# Altium schematic sheet BOOST Converter-EV3432-L-00A.SchDoc
size A4; SheetNumber: 1; SheetTotal: 2
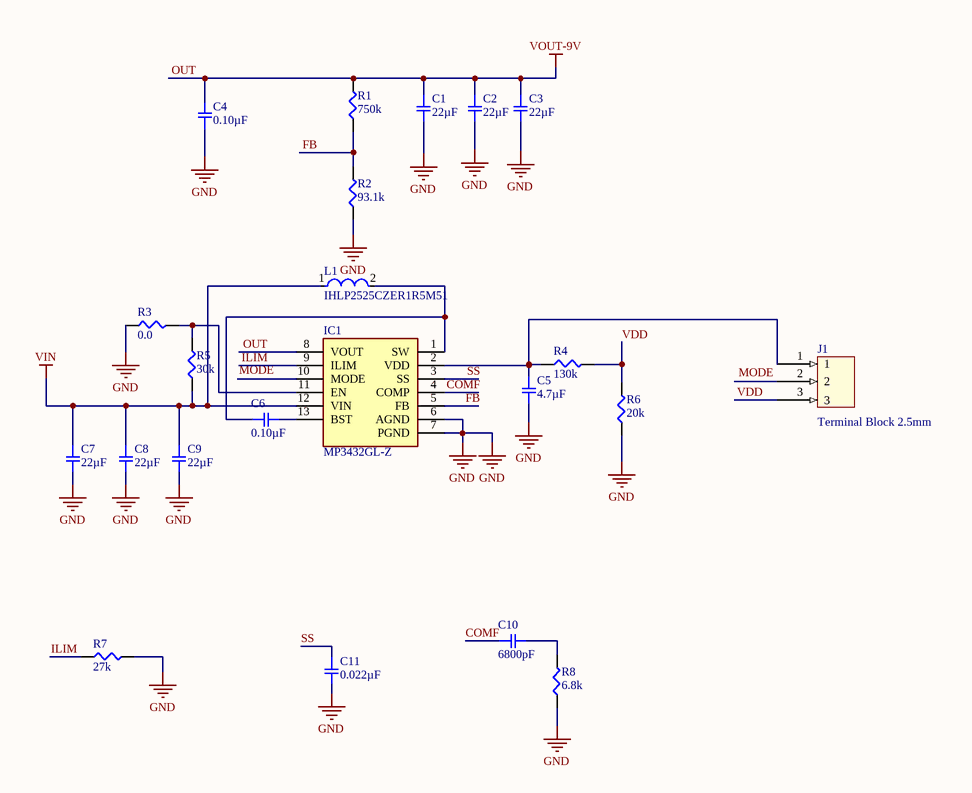
[diagram p0: BOOST Converter-EV3432-L-00A.SchDoc]

## Parts
C1  22µF  [SMD-1206C]
C2  22µF  [SMD-1206C]
C3  22µF  [SMD-1206C]
C4  0.10µF  [SMD-0402C]
C5  4.7µF  [SMD-0402C]
C6  0.10µF  [SMD-0402C]
C7  22µF  [SMD-1206C]
C8  22µF  [SMD-1206C]
C9  22µF  [SMD-1206C]
C10  6800pF  [SMD-0402C]
C11  0.022µF  [SMD-0402C]
IC1  MP3432GL-Z  [MP3432GLZ]
J1  Terminal Block 2.5mm  [CON3_100_TB_TH_ST]
L1  IHLP2525CZER1R5M51  [FP-IHLP-2525CZ-FP_2_413x3-MFG]
R1  750k  [SMD-0402-RES]
R2  93.1k  [SMD-0402-RES]
R3  0.0  [SMD-0402-RES]
R4  130k  [SMD-0402-RES]
R5  30k  [SMD-0402-RES]
R6  20k  [SMD-0402-RES]
R7  27k  [SMD-0402-RES]
R8  6.8k  [SMD-0402-RES]

## Nets
GND: C1.2 C2.2 C3.2 C4.1 C5.2 C7.2 C8.2 C9.2 C11.2 IC1.6(AGND) IC1.7(PGND) R2.1 R3.1 R6.1 R7.2 R8.1
OUT: C1.1 C2.1 C3.1 C4.2 IC1.8(VOUT) R1.2  [also labelled VOUT-9V]
VIN: C7.1 C8.1 C9.1 IC1.12(VIN) L1.1 R5.1
COMF: C10.1 IC1.4(COMP)
FB: IC1.5(FB) R1.1 R2.2
ILIM: IC1.9(ILIM) R7.1
SS: C11.1 IC1.3(SS)
VDD: J1.3 R4.2 R6.2
NetC5_1: C5.1 IC1.2(VDD) J1.1 R4.1
NetC6_1: C6.1 IC1.1(SW) L1.2
NetC6_2: C6.2 IC1.13(BST)
NetC10_2: C10.2 R8.2
NetIC1_11: IC1.11(EN) R3.2 R5.2

Not connected (* = marked no-connect by the designer): IC1 10(MODE); J1 2

## Notes on the sheet
- Labels drawn without touching a wire or pin: MODE

## Library data of the parts
C1-C3 C7-C9 = GRT31CR61E226ME01L: CAP CER 22UF 25V X5R 1206; Manufacturer: Murata Electronics North America; Factory Stock: 0; Unit Price (USD): 0.52; Minimum Quantity: 1; Tolerance: ±20%; Datasheets: http://search.murata.co.jp/Ceramy/image/img/A01X/G101/ENG/GRT31CR61E226ME01-01.pdf; Image: //media.digikey.com/Renders/Murata%20Renders/GR331BD72E473KW01L.jpg; Digi-Key Part Number: 490-12451-1-ND; Part Number: GRT31CR61E226ME01L; Quantity Available: 4719; @ qty: 0; Packaging: Cut Tape (CT); Series: GRT; Part Status: Active; Value: 22µF; Voltage: 25V; Temperature Coefficient: X5R; Operating Temperature: -55°C ~ 85°C; Features: -; Ratings: AEC-Q200; Applications: Automotive; Mounting Type: Surface Mount, MLCC; Package / Case: 1206 (3216 Metric); Size / Dimension: 0.126" L x 0.063" W (3.20mm x 1.60mm); Height - Seated (Max): -; Thickness (Max): 0.071" (1.80mm); Lead Spacing: -; Lead Style: -
C4 C6 = GRM155R61E104KA87D: CAP CER 0.1UF 25V X5R 0402; Manufacturer: Murata Electronics North America; Factory Stock: 0; Unit Price (USD): 0.1; Minimum Quantity: 1; Tolerance: ±10%; Datasheets: http://www.murata.com/~/media/webrenewal/support/library/catalog/products/capacitor/mlcc/c02e.pdf; Image: //media.digikey.com/Renders/Murata%20Renders/ZRB-SERIES-0402.jpg; Digi-Key Part Number: 490-5920-1-ND; Part Number: GRM155R61E104KA87D; Quantity Available: 2653187; @ qty: 0; Packaging: Cut Tape (CT); Series: GRM; Part Status: Active; Value: 0.10µF; Voltage: 25V; Temperature Coefficient: X5R; Operating Temperature: -55°C ~ 85°C; Features: -; Ratings: -; Applications: General Purpose; Mounting Type: Surface Mount, MLCC; Package / Case: 0402 (1005 Metric); Size / Dimension: 0.039" L x 0.020" W (1.00mm x 0.50mm); Height - Seated (Max): -; Thickness (Max): 0.022" (0.55mm); Lead Spacing: -; Lead Style: -
C5 = GRM153R60J475ME15D: CAP CER 4.7UF 6.3V X5R 0402; Manufacturer: Murata Electronics North America; Factory Stock: 0; Unit Price (USD): 0.27; Minimum Quantity: 1; Tolerance: ±20%; Datasheets: http://psearch.en.murata.com/capacitor/product/GRM153R60J475ME15%23.pdf; Image: //media.digikey.com/Renders/Murata%20Renders/ZRB-SERIES-0402.jpg; Digi-Key Part Number: 490-13232-1-ND; Part Number: GRM153R60J475ME15D; Quantity Available: 30412; @ qty: 0; Packaging: Cut Tape (CT); Series: GRM; Part Status: Active; Value: 4.7µF; Voltage: 6.3V; Temperature Coefficient: X5R; Operating Temperature: -55°C ~ 85°C; Features: Derating Recommended; Ratings: -; Applications: General Purpose; Mounting Type: Surface Mount, MLCC; Package / Case: 0402 (1005 Metric); Size / Dimension: 0.039" L x 0.020" W (1.00mm x 0.50mm); Height - Seated (Max): -; Thickness (Max): 0.013" (0.33mm); Lead Spacing: -; Lead Style: -
C10 = GCM155R71H682KA55D: CAP CER 6800PF 50V X7R 0402; Manufacturer: Murata Electronics North America; Factory Stock: 0; Unit Price (USD): 0.1; Minimum Quantity: 1; Tolerance: ±10%; Datasheets: http://www.murata.com/~/media/webrenewal/support/library/catalog/products/capacitor/mlcc/c03e.ashx; Image: //media.digikey.com/Renders/Murata%20Renders/ZRB-SERIES-0402.jpg; Digi-Key Part Number: 490-11152-1-ND; Part Number: GCM155R71H682KA55D; Quantity Available: 13886; @ qty: 0; Packaging: Cut Tape (CT); Series: GCM; Part Status: Active; Value: 6800pF; Voltage: 50V; Temperature Coefficient: X7R; Operating Temperature: -55°C ~ 125°C; Features: -; Ratings: AEC-Q200; Applications: Automotive; Mounting Type: Surface Mount, MLCC; Package / Case: 0402 (1005 Metric); Size / Dimension: 0.039" L x 0.020" W (1.00mm x 0.50mm); Height - Seated (Max): -; Thickness (Max): 0.022" (0.55mm); Lead Spacing: -; Lead Style: -
C11 = GRM155R61C223KA01D: CAP CER 0.022UF 16V X5R 0402; Manufacturer: Murata Electronics North America; Factory Stock: 0; Unit Price (USD): 0.1; Minimum Quantity: 1; Tolerance: ±10%; Datasheets: http://www.murata.com/~/media/webrenewal/support/library/catalog/products/capacitor/mlcc/c02e.pdf; Image: //media.digikey.com/Renders/Murata%20Renders/ZRB-SERIES-0402.jpg; Digi-Key Part Number: 490-6312-1-ND; Part Number: GRM155R61C223KA01D; Quantity Available: 94602; @ qty: 0; Packaging: Cut Tape (CT); Series: GRM; Part Status: Active; Value: 0.022µF; Voltage: 16V; Temperature Coefficient: X5R; Operating Temperature: -55°C ~ 85°C; Features: -; Ratings: -; Applications: General Purpose; Mounting Type: Surface Mount, MLCC; Package / Case: 0402 (1005 Metric); Size / Dimension: 0.039" L x 0.020" W (1.00mm x 0.50mm); Height - Seated (Max): -; Thickness (Max): 0.022" (0.55mm); Lead Spacing: -
IC1 = MP3432GL-Z: Integrated Circuit; Manufacturer_Name: Monolithic Power Systems (MPS); Height: 1mm; Manufacturer_Part_Number: MP3432GL-Z; Mouser Part Number: 946-MP3432GL-Z; Mouser Price/Stock: https://www.mouser.co.uk/ProductDetail/Monolithic-Power-Systems-MPS/MP3432GL-Z?qs=rkhjVJ6%2F3EKdOTMiti3nIQ%3D%3D
J1 = CON-TB_3X1-100-ST-TH: 3 Pins, 1 Row 2.54mm Pitch, straight Connector, male; Manufacturer Part Number: 1725669; Manufacturer: Phoenix Contact; Alternate Part Number-1: NA; Case/Package: TH-CON; Supplier-1: SP ROAD; Supplier Part Number-1: 1725669
L1 = CMP-02424-000221-1: Commercial Inductors, High Temperature (155 °C) Series 1.5uH 10.6A 13.2mΩ 20%
R1 = ERJ-2RKF7503X: RES SMD 750K OHM 1% 1/10W 0402; Manufacturer: Panasonic Electronic Components; Factory Stock: 0; Unit Price (USD): 0.00496; @ qty: 1500; Minimum Quantity: 1; Power (Watts): 0.1W, 1/10W; Temperature Coefficient: ±100ppm/°C; Part Number: ERJ-2RKF7503X; Datasheets: http://industrial.panasonic.com/www-cgi/jvcr13pz.cgi?E+PZ+3+AOA0002+ERJ2RKF7503X+7+WW; Image: //media.digikey.com/Photos/Panasonic%20Photos/ERJ-PA2-Series.jpg; Digi-Key Part Number: P750KLCT-ND; Quantity Available: 78807; Packaging: Cut Tape (CT); Series: ERJ; Part Status: Active; Value: 750k; Tolerance: ±1%; Composition: Thick Film; Features: Automotive AEC-Q200; Operating Temperature: -55°C ~ 155°C; Package / Case: 0402 (1005 Metric); Supplier Device Package: 0402; Size / Dimension: 0.039" L x 0.020" W (1.00mm x 0.50mm); Height - Seated (Max): 0.016" (0.40mm); Number of Terminations: 2; Failure Rate: -
R2 = ERJ-2RKF9312X: RES SMD 93.1K OHM 1% 1/10W 0402; Manufacturer: Panasonic Electronic Components; Factory Stock: 0; Unit Price (USD): 0.00496; @ qty: 1500; Minimum Quantity: 1; Power (Watts): 0.1W, 1/10W; Temperature Coefficient: ±100ppm/°C; Part Number: ERJ-2RKF9312X; Datasheets: http://industrial.panasonic.com/www-cgi/jvcr13pz.cgi?E+PZ+3+AOA0002+ERJ2RKF9312X+7+WW; Image: //media.digikey.com/Photos/Panasonic%20Photos/ERJ-PA2-Series.jpg; Digi-Key Part Number: P93.1KLCT-ND; Quantity Available: 130315; Packaging: Cut Tape (CT); Series: ERJ; Part Status: Active; Value: 93.1k; Tolerance: ±1%; Composition: Thick Film; Features: Automotive AEC-Q200; Operating Temperature: -55°C ~ 155°C; Package / Case: 0402 (1005 Metric); Supplier Device Package: 0402; Size / Dimension: 0.039" L x 0.020" W (1.00mm x 0.50mm); Height - Seated (Max): 0.016" (0.40mm); Number of Terminations: 2; Failure Rate: -
R3 = ERJ-2GE0R00X: RES SMD 0.0OHM JUMPER 1/10W 0402; Manufacturer: Panasonic Electronic Components; Factory Stock: 0; Unit Price (USD): 0.00384; @ qty: 1500; Minimum Quantity: 1; Power (Watts): 0.1W, 1/10W; Part Number: ERJ-2GE0R00X; Datasheets: http://industrial.panasonic.com/www-cgi/jvcr13pz.cgi?E+PZ+3+AOA0001+ERJ2GE0R00X+7+WW; Image: //media.digikey.com/Photos/Panasonic%20Photos/ERJ-PA2-Series.jpg; Digi-Key Part Number: P0.0JCT-ND; Quantity Available: 3152483; Packaging: Cut Tape (CT); Series: ERJ; Part Status: Active; Value: 0.0; Tolerance: Jumper; Composition: Thick Film; Features: Automotive AEC-Q200; Temperature Coefficient: -; Operating Temperature: -55°C ~ 155°C; Package / Case: 0402 (1005 Metric); Supplier Device Package: 0402; Size / Dimension: 0.039" L x 0.020" W (1.00mm x 0.50mm); Height - Seated (Max): 0.016" (0.40mm); Number of Terminations: 2; Failure Rate: -
R4 = ERJ-2RKF1303X: RES SMD 130K OHM 1% 1/10W 0402; Manufacturer: Panasonic Electronic Components; Factory Stock: 0; Unit Price (USD): 0.00496; @ qty: 1500; Minimum Quantity: 1; Power (Watts): 0.1W, 1/10W; Temperature Coefficient: ±100ppm/°C; Part Number: ERJ-2RKF1303X; Datasheets: http://industrial.panasonic.com/www-cgi/jvcr13pz.cgi?E+PZ+3+AOA0002+ERJ2RKF1303X+7+WW; Image: //media.digikey.com/Photos/Panasonic%20Photos/ERJ-PA2-Series.jpg; Digi-Key Part Number: P130KLCT-ND; Quantity Available: 69838; Packaging: Cut Tape (CT); Series: ERJ; Part Status: Active; Value: 130k; Tolerance: ±1%; Composition: Thick Film; Features: Automotive AEC-Q200; Operating Temperature: -55°C ~ 155°C; Package / Case: 0402 (1005 Metric); Supplier Device Package: 0402; Size / Dimension: 0.039" L x 0.020" W (1.00mm x 0.50mm); Height - Seated (Max): 0.016" (0.40mm); Number of Terminations: 2; Failure Rate: -
R5 = ERJ-2RKF3002X: RES SMD 30K OHM 1% 1/10W 0402; Manufacturer: Panasonic Electronic Components; Factory Stock: 0; Unit Price (USD): 0.00496; @ qty: 1500; Minimum Quantity: 1; Power (Watts): 0.1W, 1/10W; Temperature Coefficient: ±100ppm/°C; Part Number: ERJ-2RKF3002X; Datasheets: http://industrial.panasonic.com/www-cgi/jvcr13pz.cgi?E+PZ+3+AOA0002+ERJ2RKF3002X+7+WW; Image: //media.digikey.com/Photos/Panasonic%20Photos/ERJ-PA2-Series.jpg; Digi-Key Part Number: P30.0KLCT-ND; Quantity Available: 144382; Packaging: Cut Tape (CT); Series: ERJ; Part Status: Active; Value: 30k; Tolerance: ±1%; Composition: Thick Film; Features: Automotive AEC-Q200; Operating Temperature: -55°C ~ 155°C; Package / Case: 0402 (1005 Metric); Supplier Device Package: 0402; Size / Dimension: 0.039" L x 0.020" W (1.00mm x 0.50mm); Height - Seated (Max): 0.016" (0.40mm); Number of Terminations: 2; Failure Rate: -
R6 = ERJ-2RKF2002X: RES SMD 20K OHM 1% 1/10W 0402; Manufacturer: Panasonic Electronic Components; Factory Stock: 0; Unit Price (USD): 0.00496; @ qty: 1500; Minimum Quantity: 1; Power (Watts): 0.1W, 1/10W; Temperature Coefficient: ±100ppm/°C; Part Number: ERJ-2RKF2002X; Datasheets: http://industrial.panasonic.com/www-cgi/jvcr13pz.cgi?E+PZ+3+AOA0002+ERJ2RKF2002X+7+WW; Image: //media.digikey.com/Photos/Panasonic%20Photos/ERJ-PA2-Series.jpg; Digi-Key Part Number: P20.0KLCT-ND; Quantity Available: 1690955; Packaging: Cut Tape (CT); Series: ERJ; Part Status: Active; Value: 20k; Tolerance: ±1%; Composition: Thick Film; Features: Automotive AEC-Q200; Operating Temperature: -55°C ~ 155°C; Package / Case: 0402 (1005 Metric); Supplier Device Package: 0402; Size / Dimension: 0.039" L x 0.020" W (1.00mm x 0.50mm); Height - Seated (Max): 0.016" (0.40mm); Number of Terminations: 2; Failure Rate: -
R7 = ERJ-2RKF2702X: RES SMD 27K OHM 1% 1/10W 0402; Manufacturer: Panasonic Electronic Components; Factory Stock: 0; Unit Price (USD): 0.00496; @ qty: 1500; Minimum Quantity: 1; Power (Watts): 0.1W, 1/10W; Temperature Coefficient: ±100ppm/°C; Part Number: ERJ-2RKF2702X; Datasheets: http://industrial.panasonic.com/www-cgi/jvcr13pz.cgi?E+PZ+3+AOA0002+ERJ2RKF2702X+7+WW; Image: //media.digikey.com/Photos/Panasonic%20Photos/ERJ-PA2-Series.jpg; Digi-Key Part Number: P27.0KLCT-ND; Quantity Available: 113507; Packaging: Cut Tape (CT); Series: ERJ; Part Status: Active; Value: 27k; Tolerance: ±1%; Composition: Thick Film; Features: Automotive AEC-Q200; Operating Temperature: -55°C ~ 155°C; Package / Case: 0402 (1005 Metric); Supplier Device Package: 0402; Size / Dimension: 0.039" L x 0.020" W (1.00mm x 0.50mm); Height - Seated (Max): 0.016" (0.40mm); Number of Terminations: 2; Failure Rate: -
R8 = ERJ-2RKF6801X: RES SMD 6.8K OHM 1% 1/10W 0402; Manufacturer: Panasonic Electronic Components; Factory Stock: 0; Unit Price (USD): 0.00496; @ qty: 1500; Minimum Quantity: 1; Power (Watts): 0.1W, 1/10W; Temperature Coefficient: ±100ppm/°C; Part Number: ERJ-2RKF6801X; Datasheets: http://industrial.panasonic.com/www-cgi/jvcr13pz.cgi?E+PZ+3+AOA0002+ERJ2RKF6801X+7+WW; Image: //media.digikey.com/Photos/Panasonic%20Photos/ERJ-PA2-Series.jpg; Digi-Key Part Number: P6.80KLCT-ND; Quantity Available: 52531; Packaging: Cut Tape (CT); Series: ERJ; Part Status: Active; Value: 6.8k; Tolerance: ±1%; Composition: Thick Film; Features: Automotive AEC-Q200; Operating Temperature: -55°C ~ 155°C; Package / Case: 0402 (1005 Metric); Supplier Device Package: 0402; Size / Dimension: 0.039" L x 0.020" W (1.00mm x 0.50mm); Height - Seated (Max): 0.016" (0.40mm); Number of Terminations: 2; Failure Rate: -